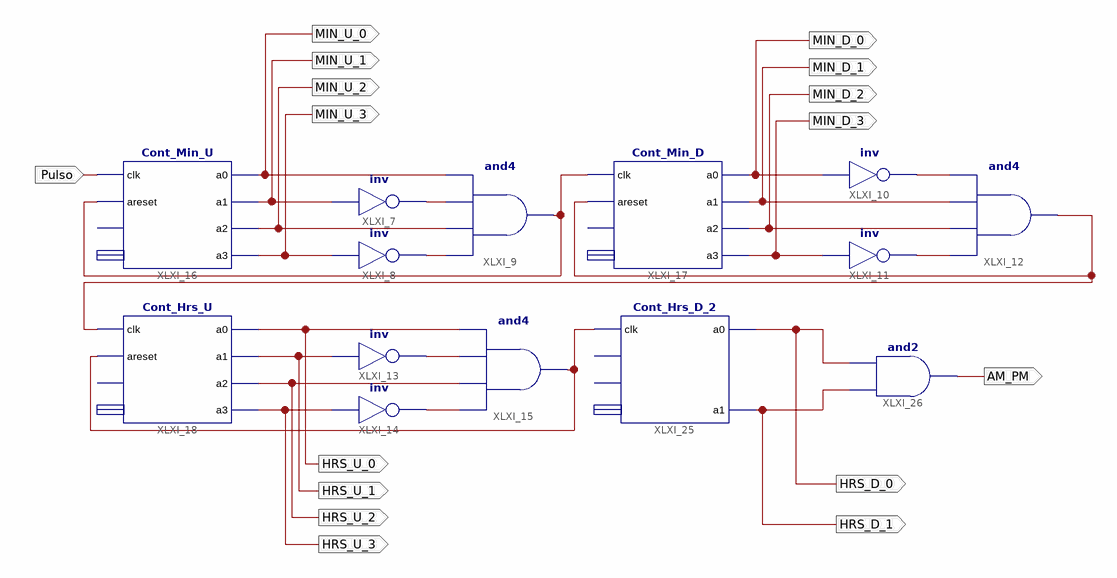
[diagram p0: schematic sheet 1]
// Xilinx ISE schematic Reloj.sch (spartan3) as structural Verilog: 14 symbols, 16 ports
module Reloj (
  input  Pulso,
  output HRS_D_0,
  output MIN_U_0,
  output MIN_U_1,
  output MIN_U_2,
  output MIN_U_3,
  output HRS_U_0,
  output HRS_U_1,
  output HRS_U_2,
  output HRS_U_3,
  output HRS_D_1,
  output MIN_D_0,
  output MIN_D_1,
  output MIN_D_2,
  output MIN_D_3,
  output AM_PM
);

  wire XLXN_45, XLXN_61, XLXN_70, XLXN_71, XLXN_76, XLXN_77, XLXN_84, XLXN_87, XLXN_91;

  not XLXI_8 (XLXN_70, MIN_U_3);
  and XLXI_9 (XLXN_61, XLXN_70, MIN_U_2, XLXN_71, MIN_U_0);
  not XLXI_10 (XLXN_76, MIN_D_0);
  and XLXI_12 (XLXN_84, XLXN_77, MIN_D_2, MIN_D_1, XLXN_76);
  not XLXI_13 (XLXN_87, HRS_U_1);
  not XLXI_14 (XLXN_91, HRS_U_3);
  and XLXI_15 (XLXN_45, XLXN_91, HRS_U_2, XLXN_87, HRS_U_0);
  not XLXI_11 (XLXN_77, MIN_D_3);
  Cont_Min_U XLXI_16 (
    .clk(Pulso), .areset(XLXN_61), .a0(MIN_U_0), .a1(MIN_U_1), .a2(MIN_U_2), .a3(MIN_U_3));  // open: aload, data
  not XLXI_7 (XLXN_71, MIN_U_1);
  Cont_Min_D XLXI_17 (
    .clk(XLXN_61), .areset(XLXN_84), .a0(MIN_D_0), .a1(MIN_D_1), .a2(MIN_D_2), .a3(MIN_D_3));  // open: aload, data
  Cont_Hrs_U XLXI_18 (
    .clk(XLXN_84), .areset(XLXN_45), .a0(HRS_U_0), .a1(HRS_U_1), .a2(HRS_U_2), .a3(HRS_U_3));  // open: aload, data
  Cont_Hrs_D_2 XLXI_25 (.clk(XLXN_45), .a0(HRS_D_0), .a1(HRS_D_1));  // open: areset, aload, data
  and XLXI_26 (AM_PM, HRS_D_1, HRS_D_0);
endmodule
